# Altium schematic sheet Audio_Output_XLR1.SchDoc: Audio Research: XLR 1 Out
size A4; DrawnBy: Connor Dack; Engineer: Connor Dack; DocumentNumber: 19; Revision: 1.0; SheetNumber: 19; SheetTotal: 20
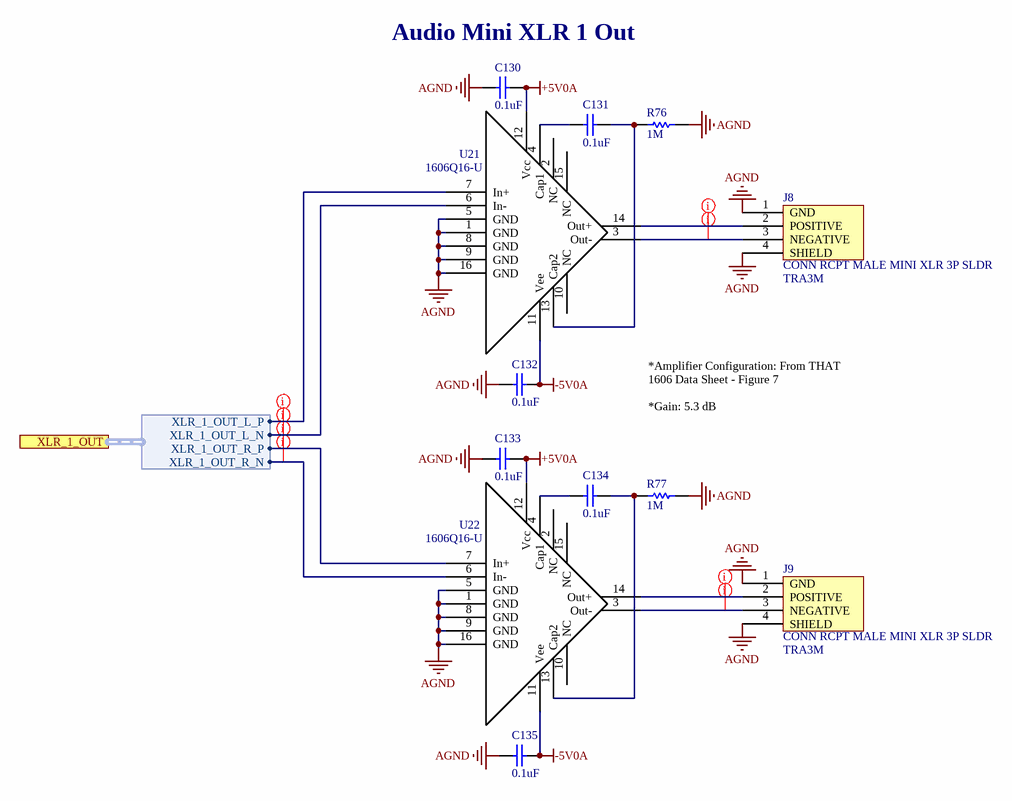
[diagram p0: Audio_Output_XLR1.SchDoc]

## Parts
C130  Capacitance: 0.1uF  [3-0603_L]  (hidden comment: CL10F104ZO8NNNC)
C131  Capacitance: 0.1uF  [3-0603_L]  (hidden comment: CL10F104ZO8NNNC)
C132  Capacitance: 0.1uF  [3-0603_L]  (hidden comment: CL10F104ZO8NNNC)
C133  Capacitance: 0.1uF  [3-0603_L]  (hidden comment: CL10F104ZO8NNNC)
C134  Capacitance: 0.1uF  [3-0603_L]  (hidden comment: CL10F104ZO8NNNC)
C135  Capacitance: 0.1uF  [3-0603_L]  (hidden comment: CL10F104ZO8NNNC)
J8  CONN RCPT MALE MINI XLR 3P SLDR  [TRA3M]
J9  CONN RCPT MALE MINI XLR 3P SLDR  [TRA3M]
R76  Resistance: 1M  [3-0603_R_L]  (hidden comment: RMCF0603FG1M00)
R77  Resistance: 1M  [3-0603_R_L]  (hidden comment: RMCF0603FG1M00)
U21  1606Q16-U  [SOP64P600X175-16N]
U22  1606Q16-U  [SOP64P600X175-16N]

## Ports
XLR_1_OUT (harness XLR_1_OUT)

## Harnesses
XLR_1_OUT: XLR_1_OUT_L_N, XLR_1_OUT_L_P, XLR_1_OUT_R_N, XLR_1_OUT_R_P

## Nets
+5V0A: C130.1 C133.1 U21.12(Vcc) U22.12(Vcc)
-5V0A: C132.1 C135.1 U21.11(Vee) U22.11(Vee)
AGND: C130.2 C132.2 C133.2 C135.2 J8.1(GND) J8.4(SHIELD) J9.1(GND) J9.4(SHIELD) R76.2 R77.2 U21.1(GND) U21.5(GND) U21.8(GND) U21.9(GND) U21.16(GND) U22.1(GND) U22.5(GND) U22.8(GND) U22.9(GND) U22.16(GND)
NetC131_1: C131.1 R76.1 U21.13(Cap2)
NetC131_2: C131.2 U21.4(Cap1)
NetC134_1: C134.1 R77.1 U22.13(Cap2)
NetC134_2: C134.2 U22.4(Cap1)
NetJ8_2: J8.2(POSITIVE) U21.14(Out+)
NetJ8_3: J8.3(NEGATIVE) U21.3(Out-)
NetJ9_2: J9.2(POSITIVE) U22.14(Out+)
NetJ9_3: J9.3(NEGATIVE) U22.3(Out-)
NetU21_6: U21.6(In-) ; port XLR_1_OUT.XLR_1_OUT_L_N
NetU21_7: U21.7(In+) ; port XLR_1_OUT.XLR_1_OUT_L_P
NetU22_6: U22.6(In-) ; port XLR_1_OUT.XLR_1_OUT_R_N
NetU22_7: U22.7(In+) ; port XLR_1_OUT.XLR_1_OUT_R_P

Not connected (* = marked no-connect by the designer): U21 2(NC) 10(NC) 15(NC); U22 2(NC) 10(NC) 15(NC)

## Layout directives
net class XLR_1_Out: NetU21_6, NetU21_7, NetU22_6, NetU22_7
net class XLR_1_Out_Conn: NetJ8_2, NetJ8_3, NetJ9_2, NetJ9_3

## Notes on the sheet
- (near C130) Audio Mini XLR 1 Out
- *Amplifier Configuration: From THAT 1606 Data Sheet - Figure 7
  *Gain: 5.3 dB
- Title:
- Sheet:
- of
- Size:
- A4
- Rev:
- Date:
- Engineer:
- Time:
- File:

## Library data of the parts
C130-C135 = CL10F104ZO8NNNC: CAP CER 0.1UF 16V Y5V 0603; Manufacturer: Samsung; Tolerance: 80%; Supplier 1: Digi-Key; Stock 1: 40000; Pricing 1: 1=0.1, 10=0.038, 100=0.0169, 500=0.01208, 1000=0.00949 (USD); Mount: Surface Mount; Case/Package: 0603; Case Code (Metric): 1608; Case Code (Imperial): 0603; Min Operating Temperature: -30°C; Max Operating Temperature: 85°C; Package Quantity: 1; Packaging: Tape and Reel; Voltage Rating: 16V; Dielectric: Y5V; Length: 1.6mm; Height: 0.8mm; Width: 0.031inch; Thickness: 0.035inch; Depth: 0.8mm; Radiation Hardening: No; ComponentLink1URL: https://datasheet.ciiva.com/25805/cl10f104zo8nnnc-25805810.pdf; ComponentLink1Description: https://datasheet.ciiva.com/25805/cl10f104zo8nnnc-25805810.pdf; ComponentLink2URL: https://datasheet.ciiva.com/16199/cl10f104zo8nnnc-16199254.pdf; ComponentLink2Description: https://datasheet.ciiva.com/16199/cl10f104zo8nnnc-16199254.pdf; Supplier Part Number 1: 1276-1258-6-ND; Manufacturer Part Number: CL10F104ZO8NNNC
J8 J9 = TRA3M: 3 Position Circular Connector Receptacle, Male Pins Solder Silver; Manufacturer: Switchcraft; Body Material: Metal,Copper Alloy; Max Current Rating: 5A; Max Voltage Rating (AC): 125V; Voltage Rating: 250V; Connector Type: Receptacle,Pin; Number of Positions: 3; Number of Ports: 1; Wire/Cable Gauge: 28AWG; Supplier 1: Digi-Key; Stock 1: 295; Pricing 1: 1=12.74, 10=9.754, 25=9.5096, 50=8.7782, 100=8.2906, 250=7.9248 (USD); Mount: Through Hole,Panel,Bulkhead,PCB; Case/Package: Metal; Contact Material: Brass,Copper Alloy; Contact Plating: Nickel,Tin,Silver; Colour: Black; Number of Terminals: 3; Housing Material: Copper Alloy; Insulation Material: Thermoplastic; Min Operating Temperature: -55°C; Max Operating Temperature: 85°C; Package Quantity: 1; Current Rating: 5A; Fastening Type: Threaded; Packaging: Bulk; Gender: Male; Termination: Solder; Number of Contacts: 3; Orientation: Right Angle; Length: 15.49mm; Height: 15.24mm; Depth: 26.92mm; REACH SVHC: No SVHC; Lead Free: Lead Free; ComponentLink1URL: https://datasheet.ciiva.com/7327/tra3m-series-cd-7327368.pdf; ComponentLink1Description: https://datasheet.ciiva.com/7327/tra3m-series-cd-7327368.pdf; ComponentLink2URL: https://datasheet.ciiva.com/16879/70214235-16879259.pdf; ComponentLink2Description: https://datasheet.ciiva.com/16879/70214235-16879259.pdf; ComponentLink3URL: https://datasheet.ciiva.com/8053/28686-8053836.pdf; ComponentLink3Description: https://datasheet.ciiva.com/8053/28686-8053836.pdf; Supplier Part Number 1: SC1550-ND; Manufacturer Part Number: TRA3M
R76 R77 = RMCF0603FG1M00: RES 1M OHM 1% 1/10W 0603; Manufacturer: Stackpole Electronics; Max Power Dissipation: 100mW; Temperature Coefficient: 100ppm/°C; Supplier 1: Digi-Key; Manufacturer Part Number: RMCF0603FG1M00; Stock 1: 129722; Pricing 1: 1=0.1, 10=0.017, 100=0.0069, 1000=0.00309, 2500=0.00268, 5000=0.00222 (USD); Mount: Surface Mount; Case/Package: 0603; Case Code (Metric): 1608; Case Code (Imperial): 0603; Contact Plating: Tin,Matte; Min Operating Temperature: -55°C; Max Operating Temperature: 155°C; Package Quantity: 1; Packaging: Tape and Reel; Tolerance: 1%; Composition: Thick Film; Number of Terminations: 2; Length: 0.061inch; Height: 0.022inch; Width: 0.031inch; Radiation Hardening: No; Lead Free: Contains Lead; ComponentLink1URL: https://www.seielect.com/Catalog/SEI-RMCF_RMCP.pdf; ComponentLink1Description: https://www.seielect.com/Catalog/SEI-RMCF_RMCP.pdf; ComponentLink2URL: https://www.seielect.com/catalog/SEI-Packaging.pdf; ComponentLink2Description: https://www.seielect.com/catalog/SEI-Packaging.pdf; Supplier Part Number 1: RMCF0603FG1M00CT-ND
U21 U22 = 1606Q16-U: Audio Amplifiers Balanced Audio Line Driver IC; Manufacturer: THAT; Max Supply Voltage: 18V; Min Supply Voltage: 4V; Nominal Supply Current: 4.9mA; Supplier 1: Mouser; Stock 1: 3475; Pricing 1: 1=4.65, 10=4.65, 50=3.91, 100=3.35, 1000=2.79, 10000=2.6 (USD); Case/Package: QSOP; Min Operating Temperature: -40°C; Max Operating Temperature: 85°C; Package Quantity: 98; Packaging: Rail/Tube; ComponentLink1URL: http://www.mouser.com/ds/2/407/1600data-6754.pdf; ComponentLink1Description: http://www.mouser.com/ds/2/407/1600data-6754.pdf; Supplier Part Number 1: 887-1606Q16-U; Manufacturer Part Number: 1606Q16-U